# EAGLE design BBB-SPI-FF-Cape (EAGLE 7.6.0)
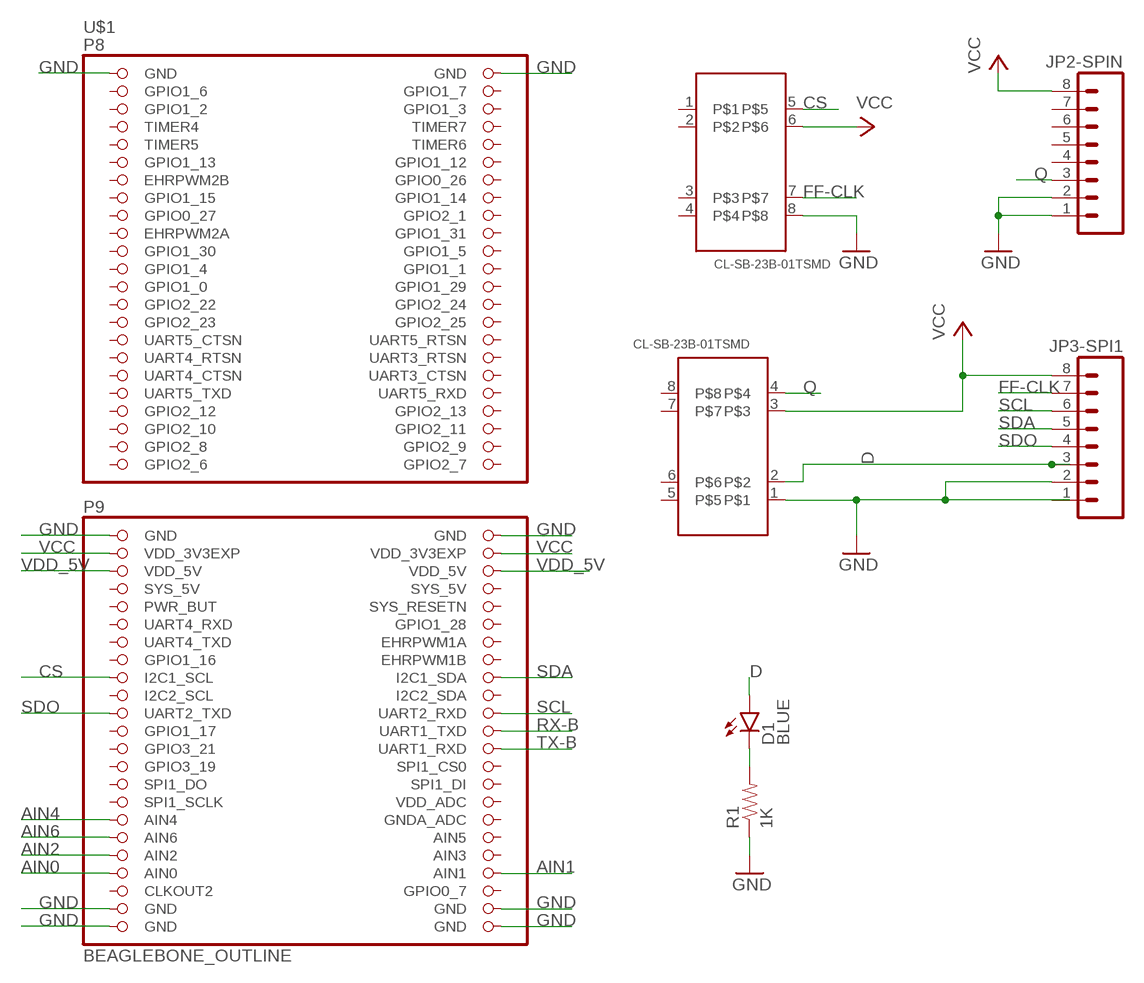
[diagram p0: schematic, sheet 1]

## Parts
D1  BLUE  LED-BLUE1206  [LED-1206]
JP2-SPIN  M08BM08B-SRSS-TB  [BM08B-SRSS-TB]
JP3-SPI1  M08BM08B-SRSS-TB  [BM08B-SRSS-TB]
R1  1K  RESISTOR1206  [1206]
U$1  BEAGLEBONE_OUTLINE  [BEAGLEBONE_SHIELD]
U$2  CL-SB-23B-01TSMD  [CL-SB-23B]
U$3  CL-SB-23B-01TSMD  [CL-SB-23B]

## Nets
AIN0: U$1.85(AIN0)
AIN1: U$1.86(AIN1)
AIN2: U$1.83(AIN2)
AIN4: U$1.79(AIN4)
AIN6: U$1.81(AIN6)
CS: U$1.63(I2C1_SCL) U$2.5
D: D1.A JP3-SPI1.3 U$3.2
FF-CLK: JP3-SPI1.7 U$2.7
GND: JP2-SPIN.1 JP2-SPIN.2 JP3-SPI1.2 R1.1 U$1.1(GND) U$1.2(GND) U$1.47(GND) U$1.48(GND) U$1.89(GND) U$1.90(GND) U$1.91(GND) U$1.92(GND) U$2.8 U$3.1
N$1: D1.C R1.2
Q: JP2-SPIN.3 U$3.4
RX-B: U$1.70(UART1_TXD)
SCL: JP3-SPI1.6 U$1.68(UART2_RXD)
SDA: JP3-SPI1.5 U$1.64(I2C1_SDA)
SDO: JP3-SPI1.4 U$1.67(UART2_TXD)
TX-B: U$1.72(UART1_RXD)
VCC: JP2-SPIN.8 JP3-SPI1.8 U$1.49(VDD_3V3EXP) U$1.50(VDD_3V3EXP) U$2.6 U$3.3
VDD_5V: U$1.51(VDD_5V) U$1.52(VDD_5V)
Unconnected: JP2-SPIN.4 JP2-SPIN.5 JP2-SPIN.6 JP2-SPIN.7 JP3-SPI1.1 U$1.3(GPIO1_6) U$1.4(GPIO1_7) U$1.5(GPIO1_2) U$1.6(GPIO1_3) U$1.7(TIMER4) U$1.8(TIMER7) U$1.9(TIMER5) U$1.10(TIMER6) U$1.11(GPIO1_13) U$1.12(GPIO1_12) U$1.13(EHRPWM2B) U$1.14(GPIO0_26) U$1.15(GPIO1_15) U$1.16(GPIO1_14) U$1.17(GPIO0_27) U$1.18(GPIO2_1) U$1.19(EHRPWM2A) U$1.20(GPIO1_31) U$1.21(GPIO1_30) U$1.22(GPIO1_5) U$1.23(GPIO1_4) U$1.24(GPIO1_1) U$1.25(GPIO1_0) U$1.26(GPIO1_29) U$1.27(GPIO2_22) U$1.28(GPIO2_24) U$1.29(GPIO2_23) U$1.30(GPIO2_25) U$1.31(UART5_CTSN) U$1.32(UART5_RTSN) U$1.33(UART4_RTSN) U$1.34(UART3_RTSN) U$1.35(UART4_CTSN) U$1.36(UART3_CTSN) U$1.37(UART5_TXD) U$1.38(UART5_RXD) U$1.39(GPIO2_12) U$1.40(GPIO2_13) U$1.41(GPIO2_10) U$1.42(GPIO2_11) U$1.43(GPIO2_8) U$1.44(GPIO2_9) U$1.45(GPIO2_6) U$1.46(GPIO2_7) U$1.54(SYS_5V) U$1.55(PWR_BUT) U$1.56(SYS_RESETN) U$1.57(UART4_RXD) U$1.58(GPIO1_28) U$1.59(UART4_TXD) U$1.60(EHRPWM1A) U$1.61(GPIO1_16) U$1.62(EHRPWM1B) U$1.65(I2C2_SCL) U$1.66(I2C2_SDA) U$1.69(GPIO1_17) U$1.71(GPIO3_21) U$1.73(GPIO3_19) U$1.74(SPI1_CS0) U$1.75(SPI1_DO) U$1.76(SPI1_DI) U$1.77(SPI1_SCLK) U$1.78(VDD_ADC) U$1.80(GNDA_ADC) U$1.82(AIN5) U$1.84(AIN3) U$1.87(CLKOUT2) U$1.88(GPIO0_7) U$2.1 U$2.2 U$2.3 U$2.4 U$3.5 U$3.6 U$3.7 U$3.8

## Power pins joined to a net without a drawn wire
SYS_5V: U$1.53(SYS_5V)

## Library data of the parts
D1 = SparkFun-LED:LED-BLUE: Blue LEDs for production use Various blue LEDs stocked by SparkFun production 0603 - DIO-08575 Rebel - DIO-09553 1206 - DIO-09911; PROD_ID: DIO-09911
JP2-SPIN JP3-SPI1 = SparkFun-Connectors:M08: Header 8 Standard 8-pin 0.1" header. Use with straight break away headers (SKU : PRT-00116), right angle break away headers (PRT-00553), swiss pins (PRT-00743), machine pins (PRT-00117), and female headers (PRT-00115).
R1 = SparkFun-Resistors:RESISTOR: Resistor Basic schematic elements and footprints for 0603, 1206, and PTH resistors.
U$1 = adafruit:BEAGLEBONE_OUTLINE: Should match A3 pinout - but not completely tested; OC_NEWARK: unknown
U$2 U$3 = MADCAT-BBB-Cape:CL-SB-23B-01T: CL-SB-01T DP3T surface mount switch 1-2, 2-3, 3-4 not tested yet; OC_NEWARK: unknown

## Net classes
0 default: width 0.254 mm

## Board
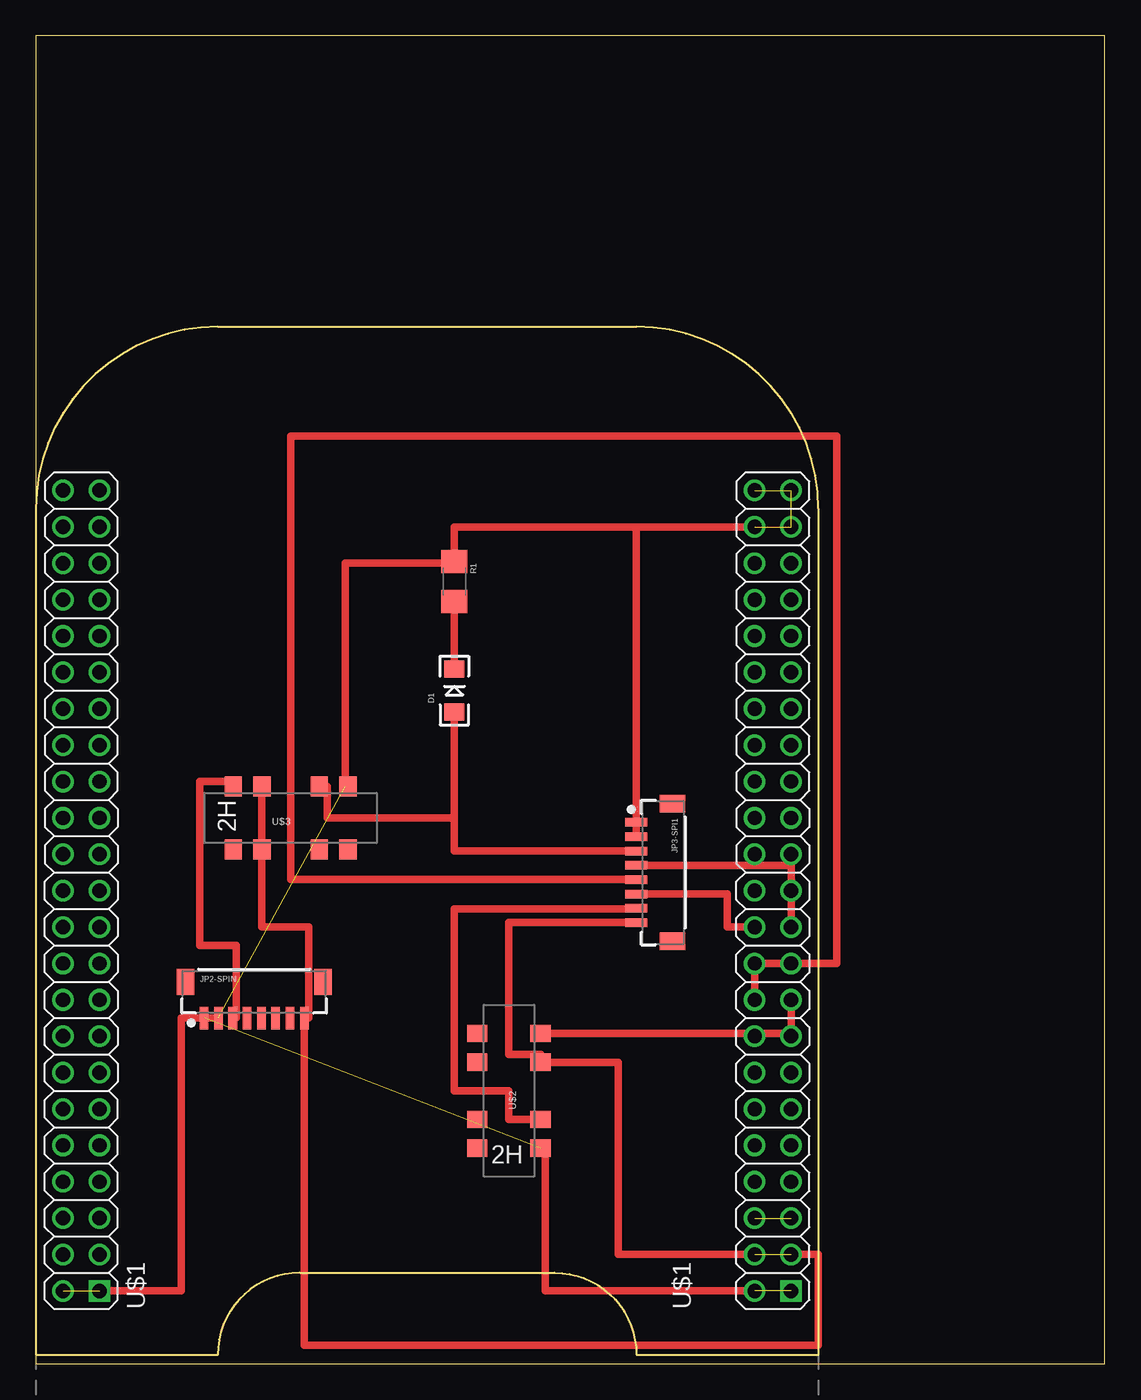
[diagram p1: board, top side]

Size 74.6 x 92.7 mm. Coordinates in mm from the lower left corner, seen from the top.
Outline: 0,0 74.6,0 74.6,92.7 0,92.7 0,0
Copper layers (1*16): Top 0.035mm / dielectric 1.5mm / Bottom 0.035mm
Design rules "default": minimum track width 10mil, minimum drill 24mil, track to track 8mil, track to pad 8mil, pad to pad 8mil, via to via 8mil, smd to smd 8mil, copper to edge 40mil, drill to drill 8mil, minimum pad ring 10mil, minimum via ring 8mil, stop-mask expansion 4mil, vias tented up to drill 0mil, thermal gap 10mil

### Footprints (pad centres in the part's own frame; a part is rotated, then mirrored left to right if it is on the bottom)
LED-1206 = smd 1.2 x 1.4: A -1.5,0; C 1.5,0
BM08B-SRSS-TB = smd 0.6 x 1.55: 1 -3.5,0; 2 -2.5,0; 3 -1.5,0; 4 -0.5,0; 5 0.5,0; 6 1.5,0; 7 2.5,0; 8 3.5,0 | smd 1.2 x 1.8: P$9 4.8,2.525; P$10 -4.8,2.525
1206 = smd 1.6 x 1.8: 1 -1.4,0; 2 1.4,0
BEAGLEBONE_SHIELD = drill 1 square: 1 4.445,19.05; 47 52.705,19.05 | drill 1: 2 1.905,19.05; 3 4.445,21.59; 4 1.905,21.59; 5 4.445,24.13; 6 1.905,24.13; 7 4.445,26.67; 8 1.905,26.67; 9 4.445,29.21; 10 1.905,29.21; 11 4.445,31.75; 12 1.905,31.75; 13 4.445,34.29; 14 1.905,34.29; 15 4.445,36.83; 16 1.905,36.83; 17 4.445,39.37; 18 1.905,39.37; 19 4.445,41.91; 20 1.905,41.91; 21 4.445,44.45; 22 1.905,44.45; 23 4.445,46.99; 24 1.905,46.99; 25 4.445,49.53; 26 1.905,49.53; 27 4.445,52.07; 28 1.905,52.07; 29 4.445,54.61; 30 1.905,54.61; 31 4.445,57.15; 32 1.905,57.15; 33 4.445,59.69; 34 1.905,59.69; 35 4.445,62.23; 36 1.905,62.23; 37 4.445,64.77; 38 1.905,64.77; 39 4.445,67.31; 40 1.905,67.31; 41 4.445,69.85; 42 1.905,69.85; 43 4.445,72.39; 44 1.905,72.39; 45 4.445,74.93; 46 1.905,74.93; 48 50.165,19.05; 49 52.705,21.59; 50 50.165,21.59; 51 52.705,24.13; 52 50.165,24.13; 53 52.705,26.67; 54 50.165,26.67; 55 52.705,29.21; 56 50.165,29.21; 57 52.705,31.75; 58 50.165,31.75; 59 52.705,34.29; 60 50.165,34.29; 61 52.705,36.83; 62 50.165,36.83; 63 52.705,39.37; 64 50.165,39.37; 65 52.705,41.91; 66 50.165,41.91; 67 52.705,44.45; 68 50.165,44.45; 69 52.705,46.99; 70 50.165,46.99; 71 52.705,49.53; 72 50.165,49.53; 73 52.705,52.07; 74 50.165,52.07; 75 52.705,54.61; 76 50.165,54.61; 77 52.705,57.15; 78 50.165,57.15; 79 52.705,59.69; 80 50.165,59.69; 81 52.705,62.23; 82 50.165,62.23; 83 52.705,64.77; 84 50.165,64.77; 85 52.705,67.31; 86 50.165,67.31; 87 52.705,69.85; 88 50.165,69.85; 89 52.705,72.39; 90 50.165,72.39; 91 52.705,74.93; 92 50.165,74.93
CL-SB-23B = smd 1.2 x 1.4: 1 -4,-2.2; 2 -2,-2.2; 3 2,-2.2; 4 4,-2.2; 5 -4,2.2; 6 -2,2.2; 7 2,2.2; 8 4,2.2

### Placement (x,y rotation side)
D1  29.21,46.99 90 top
JP2-SPIN  15.24,24.13 0 top
JP3-SPI1  41.91,34.29 270 top
R1  29.21,54.61 270 top
U$1  0,-13.97 0 top
U$2  33.02,19.05 270 top
U$3  17.78,38.1 180 top

### Tracks (layer width: path | path; a pad name or v marks a point on that pad's centre or on a via)
CS
  Top 0.508: U$2.5 52.7,23.05 U$1.63
D
  Top 0.508: JP3-SPI1.3 29.21,35.79 29.21,38.1 | 29.21,38.1 D1.A | U$3.2 20.32,40.3 20.32,38.1 29.21,38.1
FF-CLK
  Top 0.508: U$2.7 33.02,17.05 33.02,19.05 29.21,19.05 29.21,31.75 41.91,31.75 JP3-SPI1.7
GND  (7 unrouted)
  Top 0.508: U$2.8 35.56,15.05 35.56,5.08 U$1.48 | U$3.1 21.59,40.3 21.59,55.88 29.21,55.88 R1.1 29.21,58.42 41.91,58.42 | U$1.90 41.91,58.42 | JP3-SPI1.2 41.91,58.42 | JP2-SPIN.2 JP2-SPIN.1 10.16,24.13 10.16,5.08 U$1.1
N$1
  Top 0.508: D1.C R1.2
Q
  Top 0.508: JP2-SPIN.3 13.97,24.13 13.97,29.21 11.43,29.21 11.43,40.64 13.78,40.64 U$3.4
SCL
  Top 0.508: JP3-SPI1.6 48.26,32.79 48.26,30.48 U$1.68
SDA
  Top 0.508: JP3-SPI1.5 17.78,33.79 17.78,64.77 55.88,64.77 55.88,27.94 50.16,27.94 U$1.64
SDO
  Top 0.508: JP3-SPI1.4 52.7,34.79 U$1.67
VCC  (1 unrouted)
  Top 0.508: JP3-SPI1.8 33.02,30.79 33.02,21.59 35.22,21.59 U$2.6 40.64,21.05 40.64,7.62 U$1.50 | U$1.49 54.61,7.62 54.61,1.27 18.74,1.27 JP2-SPIN.8 19.05,24.13 19.05,30.48 15.78,30.48 U$3.3
VDD_5V  (1 unrouted)